# EAGLE schematic Sensor_Module_0x02_Temperature_Humidity_SHT31_v2 (EAGLE 8.5.0)
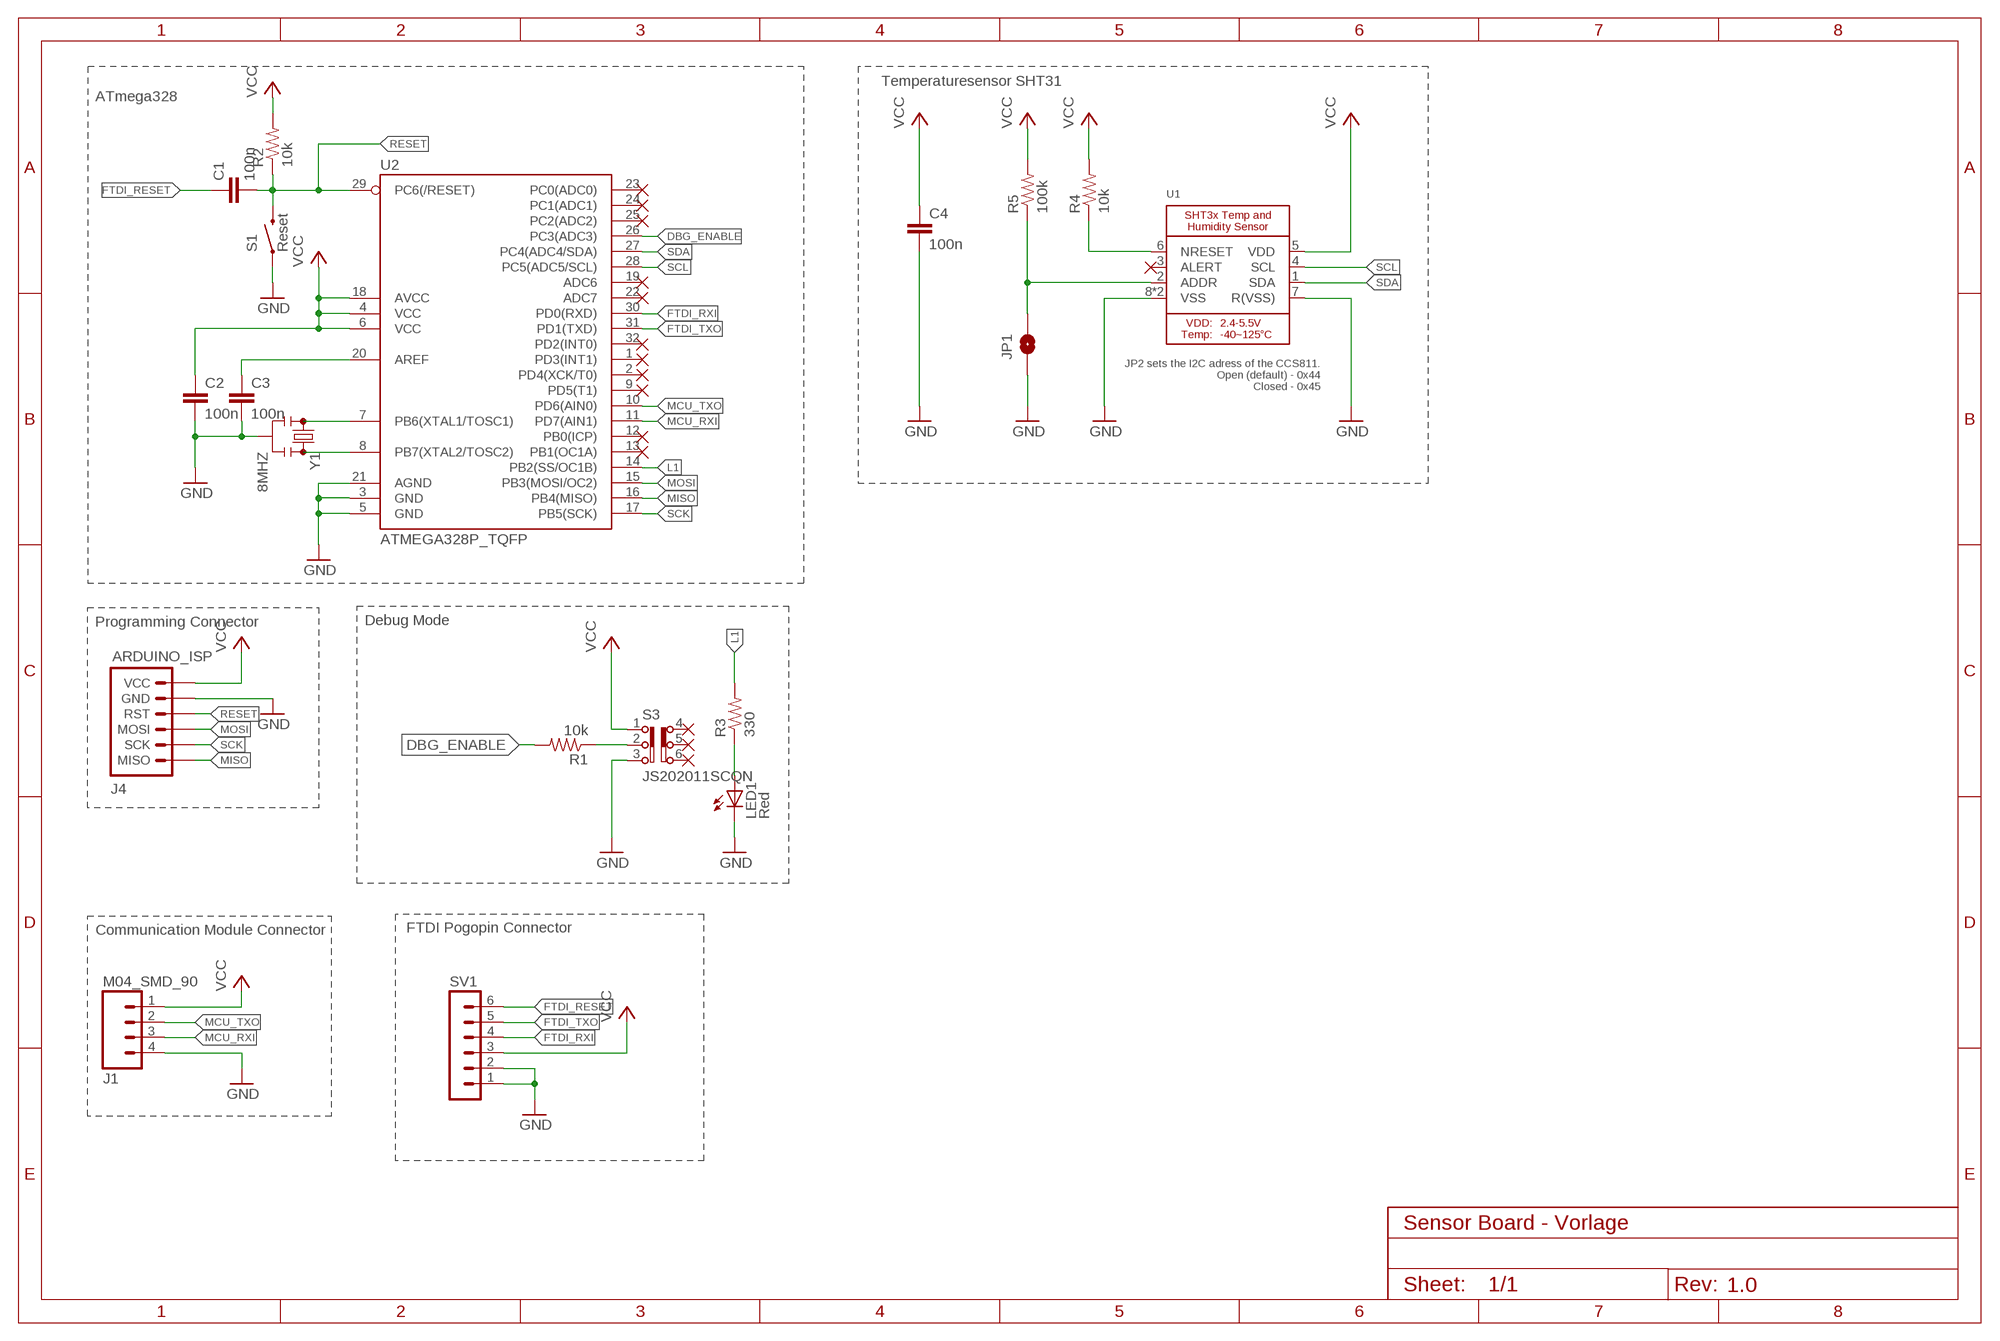
[diagram p0: schematic, sheet 1]
FRAME1 (FRAME-A4L): CNAME: Communication Module; CREVISION: 2.0

## Parts
C1  100n  C  [C0805]
C2  100n  C  [C0805]
C3  100n  C  [C0805]
C4  100n  C  [C0805]
J1  M04_SMD_90  [M04_SMD_90]
J4  ARDUINO_ISP  [M-2X3]
JP1  SPARKFUN-JUMPERS_JUMPER-SMT_2_NO_SILK  [SPARKFUN-JUMPERS_SMT-JUMPER_2_NO_SILK]
LED1  Red  LEDSML0805  [SML0805]
R1  10k  RESISTOR0805-RES  [0805]
R2  10k  RESISTOR0805-RES  [0805]
R3  330  RESISTOR0805-RES  [0805]
R4  10k  RESISTOR0805-RES  [0805]
R5  100k  RESISTOR0805-RES  [0805]
S1  Reset  PUSHBUTTON  [M-PUSHBUTTON-SMD]
S3  JS202011SCQN  [JS202011SCQN]
SV1  MA06-1  [MA06-1]
U1  MICROBUILDER_SHT3X  [MICROBUILDER_SHT3X]
U2  ATMEGA328P_TQFP  [TQFP32-08]
Y1  8MHZ  RESONATOR8MHZ  [RESONATOR-SMD]

## Nets
DBG_ENABLE: R1.2 U2.26(PC3(ADC3))
FTDI_RESET: C1.1 SV1.6
FTDI_RXI: SV1.4 U2.30(PD0(RXD))
FTDI_TXO: SV1.5 U2.31(PD1(TXD))
GND [GND]: C2.2 C3.2 C4.2 J1.4 J4.P$5(GND) JP1.1 LED1.C S1.1(LEFT) S1.2(LEFT) S3.3 SV1.1 SV1.2 U1.7(R(VSS)) U1.8(VSS) U1.THERMAL(VSS) U2.3(GND) U2.5(GND) U2.21(AGND) Y1.2
L1: R3.2 U2.14(PB2(SS/OC1B))
MCU_RXI: J1.3 U2.11(PD7(AIN1))
MCU_TXO: J1.2 U2.10(PD6(AIN0))
MISO: J4.P$1(MISO) U2.16(PB4(MISO))
MOSI: J4.P$3(MOSI) U2.15(PB3(MOSI/OC2))
N$1: U2.8(PB7(XTAL2/TOSC2)) Y1.3
N$2: U2.7(PB6(XTAL1/TOSC1)) Y1.1
N$3: R1.1 S3.2
N$4: R4.1 U1.6(NRESET)
N$5: JP1.2 R5.1 U1.2(ADDR)
N$15: C3.1 U2.20(AREF)
N$30: LED1.A R3.1
RESET: C1.2 J4.P$4(RST) R2.1 S1.3(RIGHT) S1.4(RIGHT) U2.29(PC6(/RESET))
SCK: J4.P$2(SCK) U2.17(PB5(SCK))
SCL: U1.4(SCL) U2.28(PC5(ADC5/SCL))
SDA: U1.1(SDA) U2.27(PC4(ADC4/SDA))
VCC [Vsupply]: C2.1 C4.1 J1.1 J4.P$6(VCC) R2.2 R4.2 R5.2 S3.1 SV1.3 U1.5(VDD) U2.4(VCC) U2.6(VCC) U2.18(AVCC)
Unconnected: S3.4 S3.5 S3.6 U1.3(ALERT) U2.1(PD3(INT1)) U2.2(PD4(XCK/T0)) U2.9(PD5(T1)) U2.12(PB0(ICP)) U2.13(PB1(OC1A)) U2.19(ADC6) U2.22(ADC7) U2.23(PC0(ADC0)) U2.24(PC1(ADC1)) U2.25(PC2(ADC2)) U2.32(PD2(INT0))

## Notes on the sheet
- Temperaturesensor SHT31
- ATmega328
- JP2 sets the I2C adress of the CCS811.
  Open (default) - 0x44
  Closed - 0x45
- Programming Connector | Debug Mode
- Communication Module Connector | FTDI Pogopin Connector
- Sensor Board - Vorlage
- 1.0

## Library data of the parts
C1-C4 = eagle-ltspice:C: CAPACITOR, European symbol; SPICEMODEL: NONE; SPICEPREFIX: C
J1 = myownthings:M04_SMD_90
J4 = marc_library:ARDUINO_ISP: AVR ISP 6-pin inline header for Arduino ISP
JP1 = SparkFun_CSS811_Breakout:SPARKFUN-JUMPERS_JUMPER-SMT_2_NO: Normally open jumper This jumper has two pads in close proximity to each other. Apply solder to close the connection. Round pads are easier to solder for beginners, but are a lot larger. SparkFun Product that uses the round pads: SparkFun EL Sequencer <https://www.sparkfun.com/products/12781>
LED1 = led:LED: LED OSRAM: - CHIPLED LG R971, LG N971, LY N971, LG Q971, LY Q971, LO R971, LY R971 LH N974, LH R974 LS Q976, LO Q976, LY Q976 LO Q996 - Hyper CHIPLED LW Q18S LB Q993, LB Q99A, LB R99A - SideLED LS A670, LO A670, LY A670, LG A670, LP A670 LB A673, LV A673, LT A673, LW A673 LH A674 LY A675 LS A676, LA A676, LO A676, LY A676, LW A676 LS A679, LY A679, LG A679 - Hyper Micro SIDELED® LS Y876, LA Y876, LO Y876, LY Y876 LT Y87S - SmartLED LW L88C, LW L88S LB L89C, LB L89S, LG L890 LS L89K, LO L89K, LY L89K LS L896, LA L896, LO L896, LY L896 - TOPLED LS T670, LO T670, LY T670, LG T670, LP T670 LSG T670, LSP T670, LSY T670, LOP T670, LYG T670 LG T671, LOG T671, LSG T671 LB T673, LV T673, LT T673, LW T673 LH T674 LS T676, LA T676, LO T676, LY T676, LB T676, LH T676, LSB T676, LW T676 LB T67C, LV T67C, LT T67C, LS T67K, LO T67K, LY T67K, LW E67C LS E67B, LA E67B, LO E67B, LY E67B, LB E67C, LV E67C, LT E67C LW T67C LS T679, LY T679, LG T679 LS T770, LO T770, LY T770, LG T770, LP T770 LB T773, LV T773, LT T773, LW T773 LH T774 LS E675, LA E675, LY E675, LS T675 LS T776, LA T776, LO T776, LY T776, LB T776 LHGB T686 LT T68C, LB T68C - Hyper Mini TOPLED® LB M676 - Mini TOPLED Santana® LG M470 LS M47K, LO M47K, LY M47K Source: http://www.osram.convergy.de LUXEON: - LUMILED® LXK2-PW12-R00, LXK2-PW12-S00, LXK2-PW14-U00, LXK2-PW14-V00 LXK2-PM12-R00, LXK2-PM12-S00, LXK2-PM14-U00 LXK2-PE12-Q00, LXK2-PE12-R00, LXK2-PE12-S00, LXK2-PE14-T00, LXK2-PE14-U00 LXK2-PB12-K00, LXK2-PB12-L00, LXK2-PB12-M00, LXK2-PB14-N00, LXK2-PB14-P00, LXK2-PB14-Q00 LXK2-PR12-L00, LXK2-PR12-M00, LXK2-PR14-Q00, LXK2-PR14-R00 LXK2-PD12-Q00, LXK2-PD12-R00, LXK2-PD12-S00 LXK2-PH12-R00, LXK2-PH12-S00 LXK2-PL12-P00, LXK2-PL12-Q00, LXK2-PL12-R00 Source: www.luxeon.com KINGBRIGHT: KA-3528ASYC Source: www.kingbright.com
R1-R5 = SparkFun-Passives:RESISTOR: Resistor Basic schematic elements and footprints for 0603, 1206, and PTH resistors.
S1 = marc_library:PUSHBUTTON
S3 = myownthings:JS202011SCQN: DPDT SLIDE SWITCH
SV1 = con-lstb:MA06-1: PIN HEADER; OC_FARNELL: unknown; OC_NEWARK: unknown
U1 = Adafruit SHT31 Breakout:MICROBUILDER_SHT3X: SHT3x - Digital Temperature and Humidity Sensor Supply Voltage: 2.4-5.5V Humidity Accuracy: SHT30 = +/-3%RH, SHT31 = +/-2%RH Temperature Sensor: -40~125°C (+/-0.3°C from 10-55C)
U2 = marc_library:ATMEGA328P_TQFP; PROD_ID: IC-09069
Y1 = marc_library:RESONATOR: Resonator Small SMD resonator. Used, eg, on the Arduino Pro/ Pro Mini boards. 8MHz- XTAL-08895 16MHz- XTAL-08900; PROD_ID: XTAL-08895

## Net classes
0 default: width 0.3 mm
1 Vsupply: width 0.5 mm
5 GND: width 0.5 mm